# EAGLE design BusBlaster-v2.1a (EAGLE 5.10)
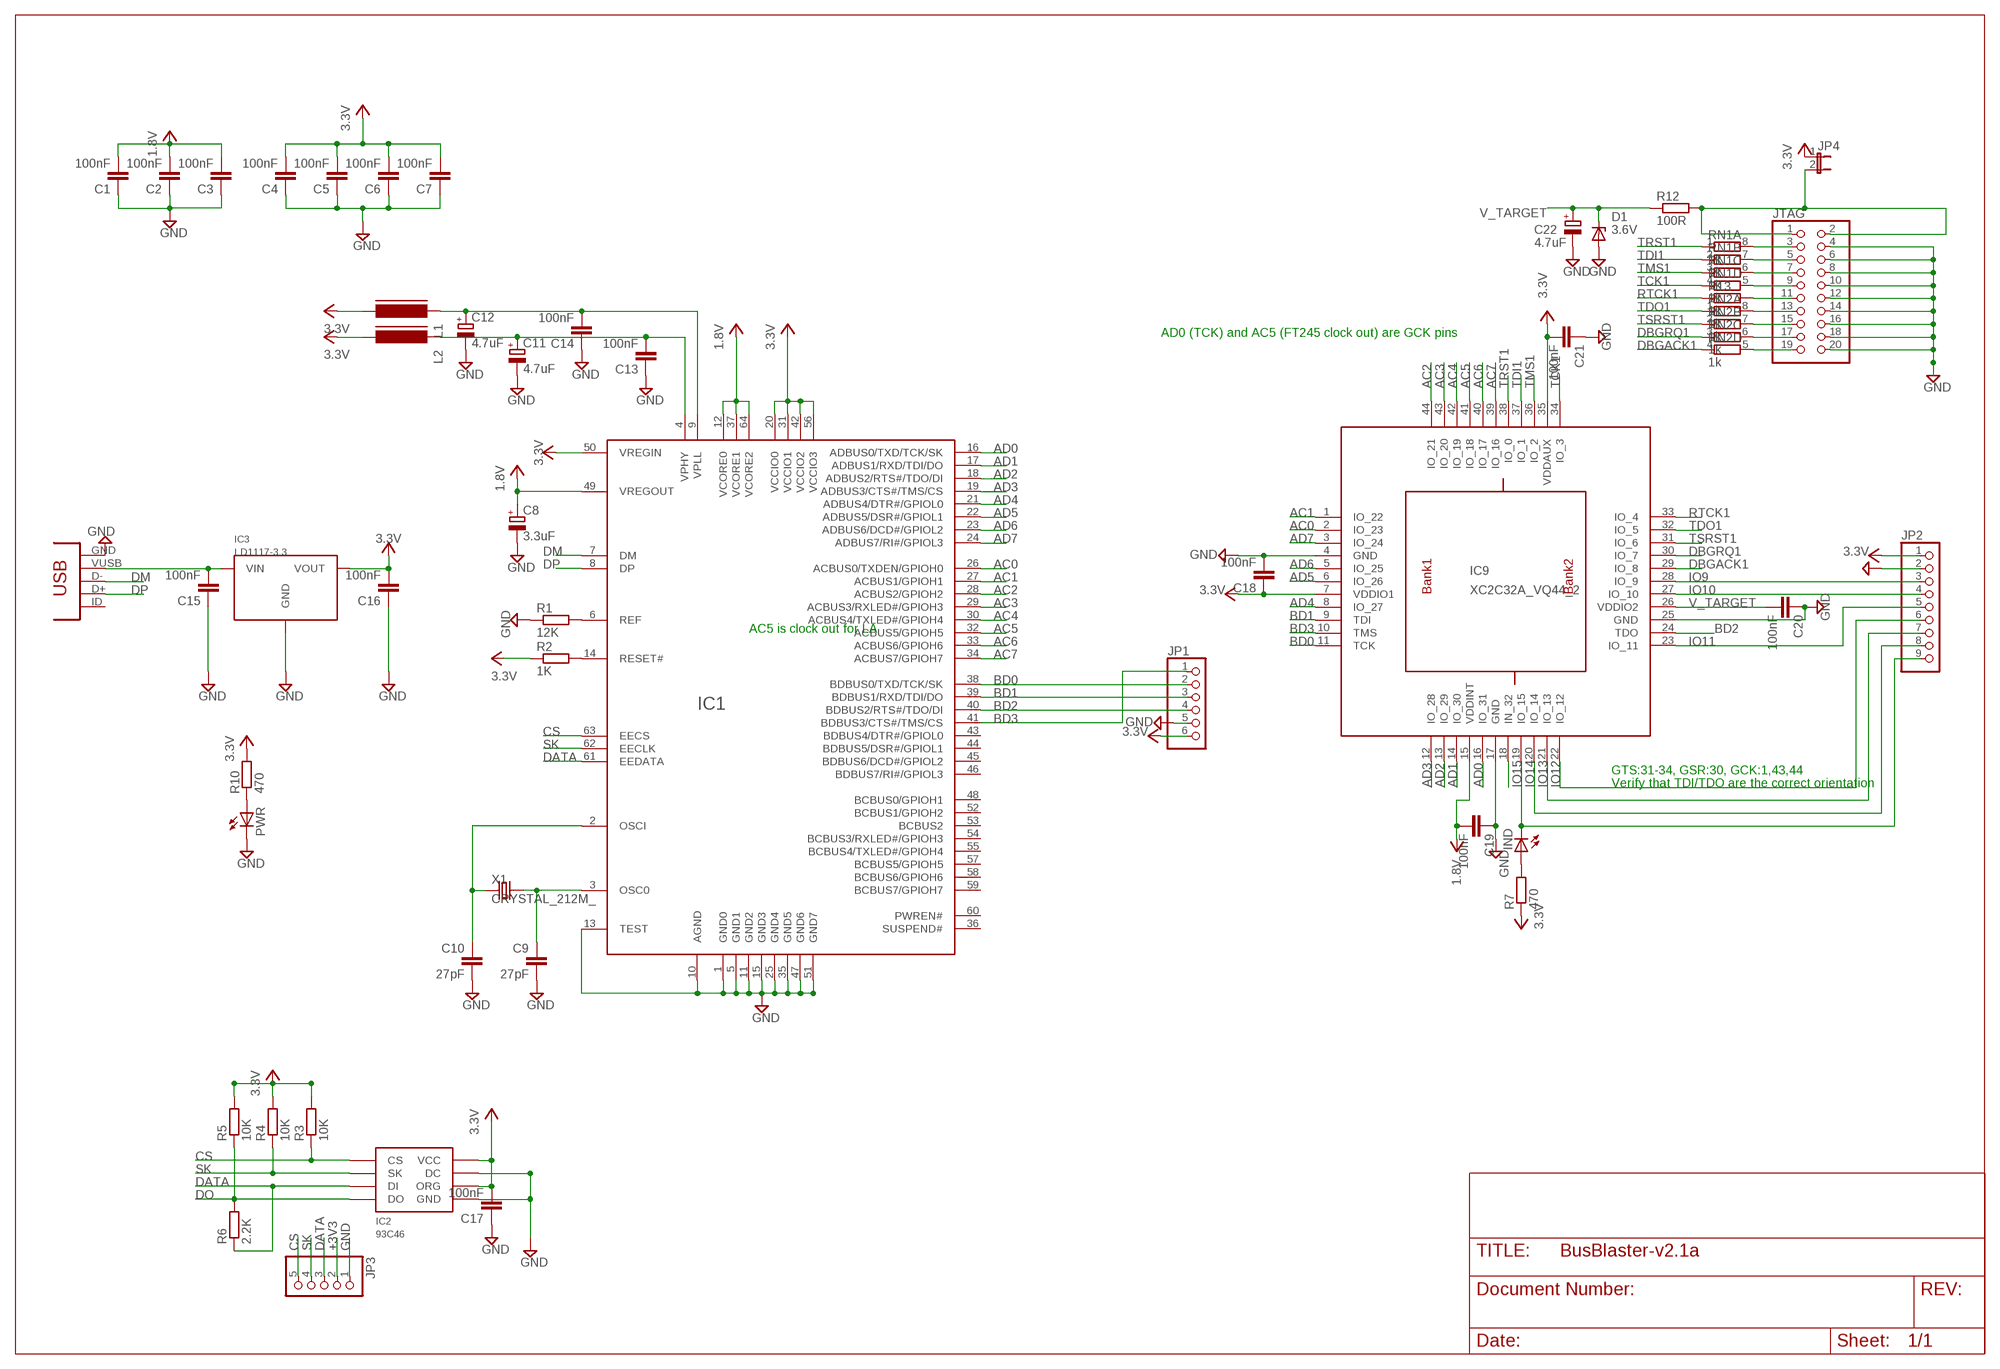
[diagram p0: schematic, sheet 1]

## Parts
C1  100nF  CAPC805  [C805]
C2  100nF  CAPC805  [C805]
C3  100nF  CAPC805  [C805]
C4  100nF  CAPC805  [C805]
C5  100nF  CAPC805  [C805]
C6  100nF  CAPC805  [C805]
C7  100nF  CAPC805  [C805]
C8  3.3uF  CAP_POLSMC_A  [SMC_A]
C9  27pF  CAPC805  [C805]
C10  27pF  CAPC805  [C805]
C11  4.7uF  CAP_POLSMC_A  [SMC_A]
C12  4.7uF  CAP_POLSMC_A  [SMC_A]
C13  100nF  CAPC805  [C805]
C14  100nF  CAPC805  [C805]
C15  100nF  CAPC805  [C805]
C16  100nF  CAPC805  [C805]
C17  100nF  CAPC805  [C805]
C18  100nF  CAPC805  [C805]
C19  100nF  CAPC805  [C805]
C20  100nF  CAPC805  [C805]
C21  100nF  CAPC805  [C805]
C22  4.7uF  CAP_POLSMC_A  [SMC_A]
D1  3.6V  ZENERSOD-123  [SOD-123]
IC1  FT2232H  [LQFP64]
IC2  93C46  [SOIC8]
IC3  LD1117-3.3  [SOT223]
IC9  XC2C32A_VQ44_2  [VQ44]
IND  LEDCHIPLED_0805  [CHIPLED_0805]
JP1  PINHD-1X6  [1X06]
JP2  PINHD-1X9  [1X09]
JP3  PINHD-1X5  [1X05]
JP4  JP1EJP  [1X02]
JTAG  PINHEAD_-_COPY_PINHD-2X10SHROUDED  [PINHEAD_-_COPY_PINSHRD_PTH_2X10]
L1  FERRITE_BEAD805  [FB805]
L2  FERRITE_BEAD805  [FB805]
PWR  LEDCHIPLED_0805  [CHIPLED_0805]
R1  12K  RESISTORR805R805  [R805]
R2  1K  RESISTORR805R805  [R805]
R3  10K  RESISTORR805R805  [R805]
R4  10K  RESISTORR805R805  [R805]
R5  10K  RESISTORR805R805  [R805]
R6  2.2K  RESISTORR805R805  [R805]
R7  470  RESISTORR805R805  [R805]
R10  470  RESISTORR805R805  [R805]
R12  100R  RESISTORR805R805  [R805]
R13  1k  RESISTORR805R805  [R805]
RN1  1k  RNETWORK  [RN8P-4R-CRA06S]
RN2  1k  RNETWORK  [RN8P-4R-CRA06S]
USB  CON-USB-MINI-BUSB1  [CONN_USB_MINI-B]
X1  CRYSTAL_212M_  [4X6]

## Nets
1.8V: C1.2 C2.2 C3.2 C8.+ C19.2 IC1.12(VCORE0) IC1.37(VCORE1) IC1.49(VREGOUT) IC1.64(VCORE2) IC9.15(VDDINT)
+3V3: C4.2 C5.2 C6.2 C7.2 C16.2 C17.2 C18.1 C21.2 IC1.20(VCCIO0) IC1.31(VCCIO1) IC1.42(VCCIO2) IC1.50(VREGIN) IC1.56(VCCIO3) IC2.6(ORG) IC2.8(VCC) IC3.2(VOUT) IC9.7(VDDIO1) IC9.35(VDDAUX) JP1.6 JP2.1 JP3.2 JP4.1 L1.2 L2.2 R2.1 R3.2 R4.2 R5.2 R7.1 R10.2 ; supply symbol labelled 3.3V
AC0: IC1.26(ACBUS0/TXDEN/GPIOH0) IC9.2(IO_23)
AC1: IC1.27(ACBUS1/GPIOH1) IC9.1(IO_22)
AC2: IC1.28(ACBUS2/GPIOH2) IC9.44(IO_21)
AC3: IC1.29(ACBUS3/RXLED#/GPIOH3) IC9.43(IO_20)
AC4: IC1.30(ACBUS4/TXLED#/GPIOH4) IC9.42(IO_19)
AC5: IC1.32(ACBUS5/GPIOH5) IC9.41(IO_18)
AC6: IC1.33(ACBUS6/GPIOH6) IC9.40(IO_17)
AC7: IC1.34(ACBUS7/GPIOH7) IC9.39(IO_16)
AD0: IC1.16(ADBUS0/TXD/TCK/SK) IC9.16(IO_31)
AD1: IC1.17(ADBUS1/RXD/TDI/DO) IC9.14(IO_30)
AD2: IC1.18(ADBUS2/RTS#/TDO/DI) IC9.13(IO_29)
AD3: IC1.19(ADBUS3/CTS#/TMS/CS) IC9.12(IO_28)
AD4: IC1.21(ADBUS4/DTR#/GPIOL0) IC9.8(IO_27)
AD5: IC1.22(ADBUS5/DSR#/GPIOL1) IC9.6(IO_26)
AD6: IC1.23(ADBUS6/DCD#/GPIOL2) IC9.5(IO_25)
AD7: IC1.24(ADBUS7/RI#/GPIOL3) IC9.3(IO_24)
BD0: IC1.38(BDBUS0/TXD/TCK/SK) IC9.11(TCK) JP1.2
BD1: IC1.39(BDBUS1/RXD/TDI/DO) IC9.9(TDI) JP1.3
BD2: IC1.40(BDBUS2/RTS#/TDO/DI) IC9.24(TDO) JP1.4
BD3: IC1.41(BDBUS3/CTS#/TMS/CS) IC9.10(TMS) JP1.1
CS: IC1.63(EECS) IC2.1(CS) JP3.5 R3.1
DATA: IC1.61(EEDATA) IC2.3(DI) JP3.3 R6.1
DBGACK1: IC9.29(IO_8) RN2.4
DBGRQ1: IC9.30(IO_7) RN2.3
DM: IC1.7(DM) USB.D-
DO: IC2.4(DO) R5.1 R6.2
DP: IC1.8(DP) USB.D+
GND: C1.1 C2.1 C3.1 C4.1 C5.1 C6.1 C7.1 C8.- C9.2 C10.2 C11.- C12.- C13.1 C14.1 C15.1 C16.1 C17.1 C18.2 C19.1 C20.1 C21.1 C22.- D1.A IC1.1(GND0) IC1.5(GND1) IC1.10(AGND) IC1.11(GND2) IC1.13(TEST) IC1.15(GND3) IC1.25(GND4) IC1.35(GND5) IC1.47(GND6) IC1.51(GND7) IC2.5(GND) IC2.7(DC) IC3.1(GND) IC9.4(GND) IC9.17(GND) IC9.18(IN_32) IC9.25(GND) JP1.5 JP2.2 JP3.1 JTAG.4 JTAG.6 JTAG.8 JTAG.10 JTAG.12 JTAG.14 JTAG.16 JTAG.18 JTAG.20 PWR.C R1.1 USB.GND
IO9: IC9.28(IO_9) JP2.3
IO10: IC9.27(IO_10) JP2.4
IO11: IC9.23(IO_11) JP2.5
IO12: IC9.22(IO_12) JP2.6
IO13: IC9.21(IO_13) JP2.7
IO14: IC9.20(IO_14) JP2.8
IO15: IC9.19(IO_15) IND.C JP2.9
N$1: C9.1 IC1.3(OSC0) X1.2(X2)
N$2: C10.1 IC1.2(OSCI) X1.1(X1)
N$3: IC1.14(RESET#) R2.2
N$4: IC1.6(REF) R1.2
N$5: C15.2 IC3.3(VIN) USB.VUSB
N$6: PWR.A R10.1
N$7: IND.A R7.2
N$9: JTAG.13 RN2.8
N$10: JTAG.15 RN2.7
N$11: JTAG.17 RN2.6
N$12: JTAG.19 RN2.5
N$13: JTAG.3 RN1.8
N$14: JTAG.5 RN1.7
N$15: JTAG.7 RN1.6
N$16: JTAG.9 RN1.5
N$17: JTAG.11 R13.2
RTCK1: IC9.33(IO_4) R13.1
SK: IC1.62(EECLK) IC2.2(SK) JP3.4 R4.1
TCK1: IC9.34(IO_3) RN1.4
TDI1: IC9.37(IO_1) RN1.2
TDO1: IC9.32(IO_5) RN2.1
TMS1: IC9.36(IO_2) RN1.3
TRST1: IC9.38(IO_0) RN1.1
TSRST1: IC9.31(IO_6) RN2.2
V_TARGET: C20.2 C22.+ D1.C IC9.26(VDDIO2) R12.1
V_TARGET_UNREG: JP4.2 JTAG.1 JTAG.2 R12.2
VPHY: C11.+ C13.2 IC1.4(VPHY) L2.1
VPLL: C12.+ C14.2 IC1.9(VPLL) L1.1
Unconnected: IC1.36(SUSPEND#) IC1.43(BDBUS4/DTR#/GPIOL0) IC1.44(BDBUS5/DSR#/GPIOL1) IC1.45(BDBUS6/DCD#/GPIOL2) IC1.46(BDBUS7/RI#/GPIOL3) IC1.48(BCBUS0/GPIOH1) IC1.52(BCBUS1/GPIOH2) IC1.53(BCBUS2) IC1.54(BCBUS3/RXLED#/GPIOH3) IC1.55(BCBUS4/TXLED#/GPIOH4) IC1.57(BCBUS5/GPIOH5) IC1.58(BCBUS6/GPIOH6) IC1.59(BCBUS7/GPIOH7) IC1.60(PWREN#) USB.BODY@1(BODY) USB.BODY@2(BODY) USB.BODY@3(BODY) USB.BODY@4(BODY) USB.ID(USBID)

## Notes on the sheet
- AD0 (TCK) and AC5 (FT245 clock out) are GCK pins
- AC5 is clock out for LA
- GTS:31-34, GSR:30, GCK:1,43,44
- Verify that TDI/TDO are the correct orientation

## Library data of the parts
C1-C7 C9 C10 C13-C21 = DP-EagleLibrary:CAP
C8 C11 C12 C22 = DP-EagleLibrary:CAP_POL
D1 = dp_devices:ZENER: Zener Diode SOD-323
IC1 = dp_devices:FT2232H: DUAL HIGH SPEED USB TO MULTIPURPOSE UART/FIFO IC
IC2 = DP-EagleLibrary:93C46
IC3 = DP-EagleLibrary:LD1117-3.3
IC9 = dp_devices:XC2C32A_VQ44_2: xc2c32a_vq44-ian edit this description Auto generated by make-symbol-device-package-bsdl.ulp Rev. 29 Source: xc2c32a_vq44-ian.bsd
IND PWR = led:LED: LED OSRAM: - CHIPLED LG R971, LG N971, LY N971, LG Q971, LY Q971, LO R971, LY R971 LH N974, LH R974 LS Q976, LO Q976, LY Q976 LO Q996 - Hyper CHIPLED LW Q18S LB Q993, LB Q99A, LB R99A - SideLED LS A670, LO A670, LY A670, LG A670, LP A670 LB A673, LV A673, LT A673, LW A673 LH A674 LY A675 LS A676, LA A676, LO A676, LY A676, LW A676 LS A679, LY A679, LG A679 - Hyper Micro SIDELED® LS Y876, LA Y876, LO Y876, LY Y876 LT Y87S - SmartLED LW L88C, LW L88S LB L89C, LB L89S, LG L890 LS L89K, LO L89K, LY L89K LS L896, LA L896, LO L896, LY L896 - TOPLED LS T670, LO T670, LY T670, LG T670, LP T670 LSG T670, LSP T670, LSY T670, LOP T670, LYG T670 LG T671, LOG T671, LSG T671 LB T673, LV T673, LT T673, LW T673 LH T674 LS T676, LA T676, LO T676, LY T676, LB T676, LH T676, LSB T676, LW T676 LB T67C, LV T67C, LT T67C, LS T67K, LO T67K, LY T67K, LW E67C LS E67B, LA E67B, LO E67B, LY E67B, LB E67C, LV E67C, LT E67C LW T67C LS T679, LY T679, LG T679 LS T770, LO T770, LY T770, LG T770, LP T770 LB T773, LV T773, LT T773, LW T773 LH T774 LS E675, LA E675, LY E675, LS T675 LS T776, LA T776, LO T776, LY T776, LB T776 LHGB T686 LT T68C, LB T68C - Hyper Mini TOPLED® LB M676 - Mini TOPLED Santana® LG M470 LS M47K, LO M47K, LY M47K Source: http://www.osram.convergy.de LUXEON: - LUMILED® LXK2-PW12-R00, LXK2-PW12-S00, LXK2-PW14-U00, LXK2-PW14-V00 LXK2-PM12-R00, LXK2-PM12-S00, LXK2-PM14-U00 LXK2-PE12-Q00, LXK2-PE12-R00, LXK2-PE12-S00, LXK2-PE14-T00, LXK2-PE14-U00 LXK2-PB12-K00, LXK2-PB12-L00, LXK2-PB12-M00, LXK2-PB14-N00, LXK2-PB14-P00, LXK2-PB14-Q00 LXK2-PR12-L00, LXK2-PR12-M00, LXK2-PR14-Q00, LXK2-PR14-R00 LXK2-PD12-Q00, LXK2-PD12-R00, LXK2-PD12-S00 LXK2-PH12-R00, LXK2-PH12-S00 LXK2-PL12-P00, LXK2-PL12-Q00, LXK2-PL12-R00 Source: www.luxeon.com KINGBRIGHT: KA-3528ASYC Source: www.kingbright.com
JP1 = pinhead:PINHD-1X6: PIN HEADER
JP2 = pinhead - Copy:PINHD-1X9: PIN HEADER
JP3 = pinhead:PINHD-1X5: PIN HEADER
JP4 = jumper:JP1E: JUMPER
JTAG = LPC1768board:PINHEAD_-_COPY_PINHD-2X10: PIN HEADER
L1 L2 = DP-EagleLibrary:FERRITE_BEAD
R1-R7 R10 R12 R13 = DP-EagleLibrary:RESISTOR
RN1 RN2 = dp_devices:RNETWORK: 4 Resistor Array 0603
USB = dp_devices:CON-USB-MINI-B: USB connector
X1 = dp_devices:CRYSTAL_2

## Board
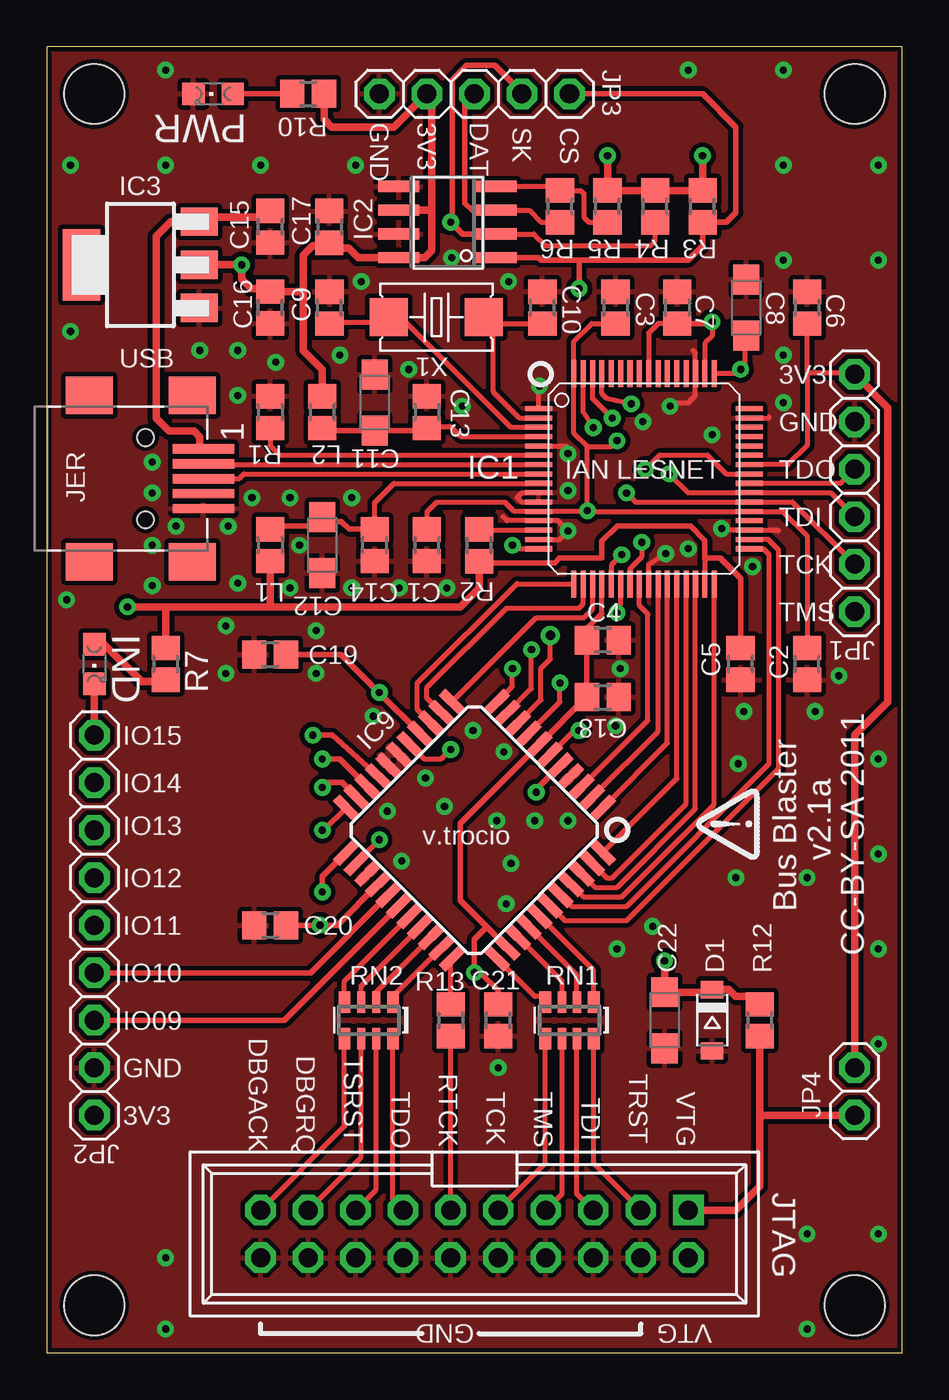
[diagram p1: board, top side]
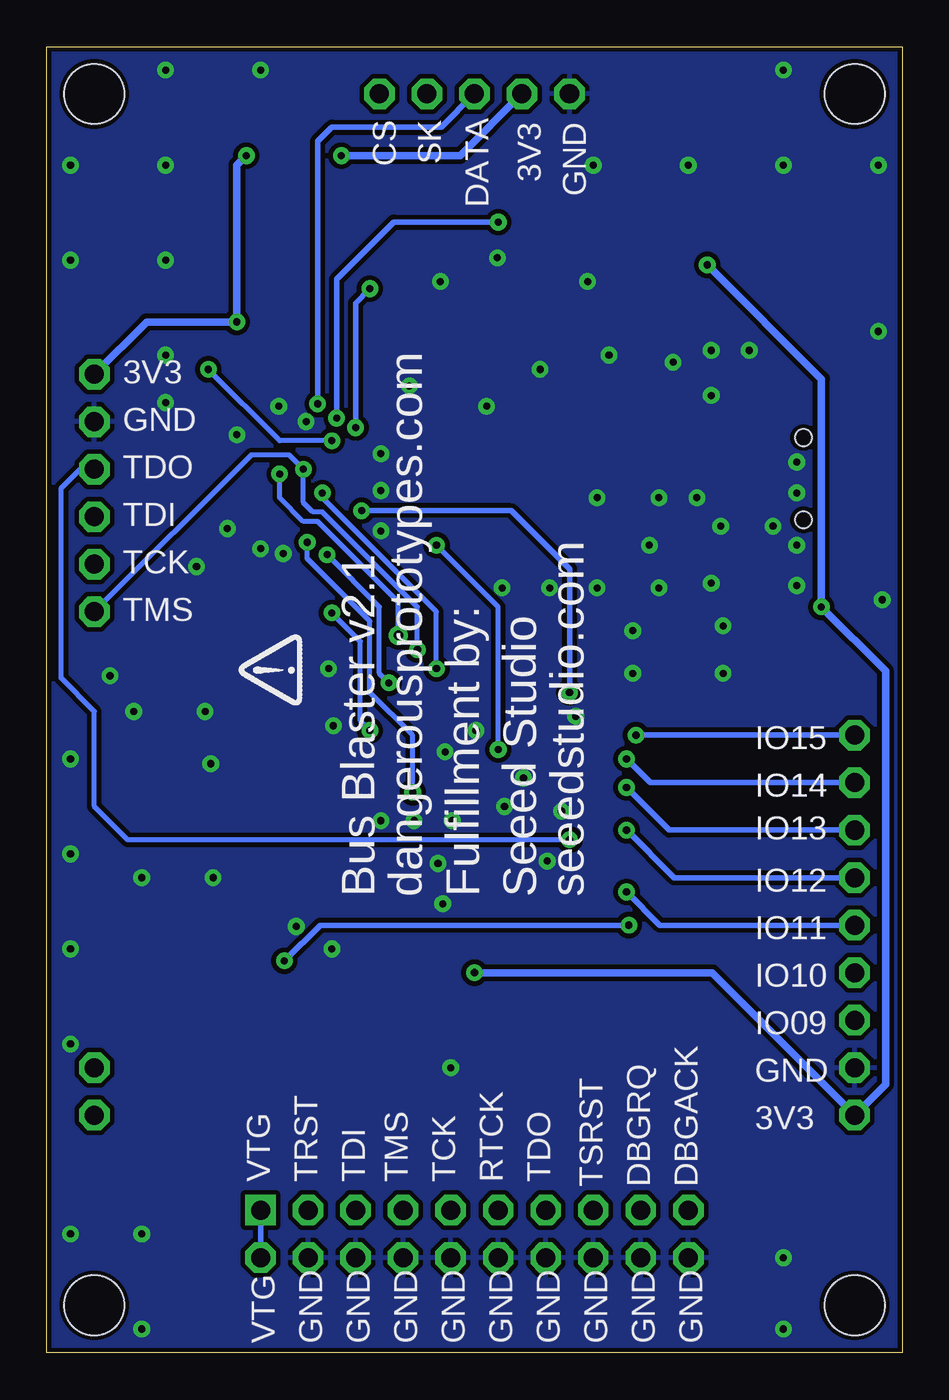
[diagram p2: board, bottom side, seen from below]

Size 45.72 x 69.83 mm. Coordinates in mm from the lower left corner, seen from the top.
Outline: 0,0 45.72,0 45.72,69.83 0,69.83 0,0
Copper layers (1*16): Top 0.035mm / dielectric 1.5mm / Bottom 0.035mm
Design rules "SparkFun": minimum track width 8mil, minimum drill 20mil, track to track 8mil, track to pad 8mil, pad to pad 8mil, via to via 8mil, smd to smd 8mil, copper to edge 10mil, drill to drill 8mil, minimum pad ring 12mil, minimum via ring 10mil, stop-mask expansion 4mil, vias tented up to drill 25mil, thermal gap 10mil
Holes 3.2 mm at 2.54,2.54 2.54,67.31 43.18,67.31 43.18,2.54

### Footprints (pad centres in the part's own frame; a part is rotated, then mirrored left to right if it is on the bottom)
C805 = smd 1.3 x 1.5: 1 -0.85,0; 2 0.85,0
SMC_A = smd 1.6 x 1.4: + -1.5,0; - 1.5,0
SOD-123 = smd 0.91 x 1.22: A 1.635,0; C -1.635,0
LQFP64 = smd 1.45 x 0.27: 1 -5.625,3.75; 2 -5.625,3.25; 3 -5.625,2.75; 4 -5.625,2.25; 5 -5.625,1.75; 6 -5.625,1.25; 7 -5.625,0.75; 8 -5.625,0.25; 9 -5.625,-0.25; 10 -5.625,-0.75; 11 -5.625,-1.25; 12 -5.625,-1.75; 13 -5.625,-2.25; 14 -5.625,-2.75; 15 -5.625,-3.25; 16 -5.625,-3.75; 33 5.625,-3.75; 34 5.625,-3.25; 35 5.625,-2.75; 36 5.625,-2.25; 37 5.625,-1.75; 38 5.625,-1.25; 39 5.625,-0.75; 40 5.625,-0.25; 41 5.625,0.25; 42 5.625,0.75; 43 5.625,1.25; 44 5.625,1.75; 45 5.625,2.25; 46 5.625,2.75; 47 5.625,3.25; 48 5.625,3.75 | smd 0.27 x 1.45: 17 -3.75,-5.625; 18 -3.25,-5.625; 19 -2.75,-5.625; 20 -2.25,-5.625; 21 -1.75,-5.625; 22 -1.25,-5.625; 23 -0.75,-5.625; 24 -0.25,-5.625; 25 0.25,-5.625; 26 0.75,-5.625; 27 1.25,-5.625; 28 1.75,-5.625; 29 2.25,-5.625; 30 2.75,-5.625; 31 3.25,-5.625; 32 3.75,-5.625; 49 3.75,5.625; 50 3.25,5.625; 51 2.75,5.625; 52 2.25,5.625; 53 1.75,5.625; 54 1.25,5.625; 55 0.75,5.625; 56 0.25,5.625; 57 -0.25,5.625; 58 -0.75,5.625; 59 -1.25,5.625; 60 -1.75,5.625; 61 -2.25,5.625; 62 -2.75,5.625; 63 -3.25,5.625; 64 -3.75,5.625
SOIC8 = smd 0.6 x 2.2: 1 -1.905,-2.6; 2 -0.635,-2.6; 3 0.635,-2.6; 4 1.905,-2.6; 5 1.905,2.6; 6 0.635,2.6; 7 -0.635,2.6; 8 -1.905,2.6
SOT223 = smd 1.5 x 2: 1 -2.3,-3.15; 2 0,-3.15; 3 2.3,-3.15 | smd 3.8 x 2: 4 0,3.15
VQ44 = smd 1.5 x 0.5: 1 -5.7,4; 2 -5.7,3.2; 3 -5.7,2.4; 4 -5.7,1.6; 5 -5.7,0.8; 6 -5.7,0; 7 -5.7,-0.8; 8 -5.7,-1.6; 9 -5.7,-2.4; 10 -5.7,-3.2; 11 -5.7,-4; 23 5.7,-4; 24 5.7,-3.2; 25 5.7,-2.4; 26 5.7,-1.6; 27 5.7,-0.8; 28 5.7,0; 29 5.7,0.8; 30 5.7,1.6; 31 5.7,2.4; 32 5.7,3.2; 33 5.7,4 | smd 0.5 x 1.5: 12 -4,-5.7; 13 -3.2,-5.7; 14 -2.4,-5.7; 15 -1.6,-5.7; 16 -0.8,-5.7; 17 0,-5.7; 18 0.8,-5.7; 19 1.6,-5.7; 20 2.4,-5.7; 21 3.2,-5.7; 22 4,-5.7; 34 4,5.7; 35 3.2,5.7; 36 2.4,5.7; 37 1.6,5.7; 38 0.8,5.7; 39 0,5.7; 40 -0.8,5.7; 41 -1.6,5.7; 42 -2.4,5.7; 43 -3.2,5.7; 44 -4,5.7
CHIPLED_0805 = smd 1.2 x 1.2: A 0,-1.05; C 0,1.05
1X06 = drill 1.016 octagon: 1 -6.35,0; 2 -3.81,0; 3 -1.27,0; 4 1.27,0; 5 3.81,0; 6 6.35,0
1X09 = drill 1.016 octagon: 1 -10.16,0; 2 -7.62,0; 3 -5.08,0; 4 -2.54,0; 5 0,0; 6 2.54,0; 7 5.08,0; 8 7.62,0; 9 10.16,0
1X05 = drill 1.016 octagon: 1 -5.08,0; 2 -2.54,0; 3 0,0; 4 2.54,0; 5 5.08,0
1X02 = drill 1.016 octagon: 1 -1.27,0; 2 1.27,0
PINHEAD_-_COPY_PINSHRD_PTH_2X10 = drill 1.016 square: 1 -11.43,-1.27 | drill 1.016 octagon: 2 -11.43,1.27; 3 -8.89,-1.27; 4 -8.89,1.27; 5 -6.35,-1.27; 6 -6.35,1.27; 7 -3.81,-1.27; 8 -3.81,1.27; 9 -1.27,-1.27; 10 -1.27,1.27; 11 1.27,-1.27; 12 1.27,1.27; 13 3.81,-1.27; 14 3.81,1.27; 15 6.35,-1.27; 16 6.35,1.27; 17 8.89,-1.27; 18 8.89,1.27; 19 11.43,-1.27; 20 11.43,1.27
FB805 = smd 1.3 x 1.5: 1 -0.85,0; 2 0.85,0
R805 = smd 1.3 x 1.5: 1 -0.85,0; 2 0.85,0
RN8P-4R-CRA06S = smd 0.63 x 1.15: 1 -1.295,-0.975; 4 1.295,-0.975; 5 1.295,0.975; 8 -1.295,0.975 | smd 0.44 x 1.15: 2 -0.4,-0.975; 3 0.4,-0.975; 6 0.4,0.975; 7 -0.4,0.975
CONN_USB_MINI-B = smd 2 x 2.5: BODY@1 -4.45,2.5; BODY@2 4.45,2.5; BODY@3 4.45,-3; BODY@4 -4.45,-3 | smd 0.5 x 3.3: D+ 0,3.1; D- -0.8,3.1; GND 1.6,3.1; ID 0.8,3.1; VUSB -1.6,3.1 | hole 0.9: -2.2,0; 2.2,0
4X6@1 = smd 2.032 x 2.032: 1 -2.54,0; 2 2.54,0

### Placement (x,y rotation side)
C1  20.32,43.18 90 top
C2  40.64,36.83 90 top
C3  30.4,55.88 270 top
C4  29.72,38.1 180 top
C5  37.08,36.83 90 top
C6  40.64,55.88 270 top
C7  33.7,55.88 270 top
C8  37.38,55.88 90 top
C9  15.11,55.88 90 top
C10  26.5,55.88 90 top
C11  17.53,50.8 90 top
C12  14.73,43.18 270 top
C13  20.32,50.29 270 top
C14  17.53,43.18 90 top
C15  11.94,60.2 90 top
C16  11.94,55.88 90 top
C17  15.11,60.2 270 top
C18  29.72,35.05 0 top
C19  11.94,37.34 0 top
C20  11.94,22.86 0 top
C21  24.13,17.78 90 top
C22  33.02,17.78 270 top
D1  35.56,17.78 270 top
IC1  31.92,46.74 0 top
IC2  21.42,60.45 90 top
IC3  5,58.17 90 top
IC9  22.86,27.94 225 top
IND  2.54,36.83 180 top
JP1  43.18,45.97 90 top
JP2  2.54,22.86 90 top
JP3  22.86,67.31 0 top
JP4  43.18,13.97 270 top
JTAG  22.86,6.35 180 top
L1  11.94,43.18 270 top
L2  14.73,50.29 90 top
PWR  8.89,67.31 90 top
R1  11.94,50.29 270 top
R2  23.11,43.18 90 top
R3  35.05,61.29 90 top
R4  32.51,61.29 90 top
R5  29.97,61.29 90 top
R6  27.43,61.29 90 top
R7  6.35,36.83 270 top
R10  13.97,67.31 0 top
R12  38.1,17.78 270 top
R13  21.59,17.78 270 top
RN1  27.94,17.78 180 top
RN2  17.21,17.78 180 top
U$1  [DP-LOGO-BOTTOM]  32.07,38.42 270 top
U$2  [DP-LOGO_TOP]  38.1,26.35 90 top
USB  5.27,46.74 270 top
X1  CRYSTAL_212M_  [4X6@1]  20.83,55.37 180 top

### Tracks (layer width: path | path; a pad name or v marks a point on that pad's centre or on a via)
1.8V  (via drill 0.38)
  Top 0.254: 28.88,48.45 28.17,49.15 IC1.64 28.17,54.08 29.12,55.03 C3.2 | 28.88,44.99 28.88,48.45 | C8.+ 37.34,54.33 37.34,52.83 v37.08,52.58 36.87,52.36 IC1.49 | C1.2 20.32,44.96 20.83,45.47 24.51,45.47 24.99,44.99 IC1.12 28.86,44.99 v28.89,45.02 28.89,44.99 IC1.37 39.34,44.99 40.64,43.69 C2.2 | 28.88,48.45 30.16,48.45 v30.48,48.77
  Top 0.305: C19.2 15.72,37.34 17.76,35.31 | 17.76,35.31 IC9.15 | 17.76,35.31 v17.78,35.31 | 28.88,44.99 28.88,45 v28.89,45.02
  Bottom 0.254: v37.08,52.58 33.27,48.77 v30.48,48.77
  Bottom 0.305: v17.78,35.31 17.78,41.91 20.89,45.02 v28.89,45.02
+3V3  (via drill 0.38)
  Top 0.254: IC1.56 32.17,54.53 32.68,55.03 C7.2 | C4.2 28.87,38.71 29.67,39.52 IC1.20 | IC1.50 35.17,53.97 35.56,54.36 v35.56,55.12 | 40.64,52.39 40.64,48.51 39.61,47.49 IC1.42 | 35.17,42.48 IC1.31 | 40.64,52.39 C6.2 | 40.64,52.39 43.12,52.39 JP1.6
  Top 0.305: C4.2 C18.1 28.84,35.05 IC9.7 22.1,28.31 22.1,24.18 23.52,22.76 | C5.2 37.08,41.41 36.01,42.48 35.17,42.48 35.17,43.44 34.42,44.2 30.48,44.2 29.67,43.39 29.67,42.48 27.4,42.48 27.15,42.23 23.5,42.23 23.4,42.33 R2.1 | 23.52,22.76 IC9.35 | C7.2 35.47,55.03 v35.56,55.12 | C21.2 24.13,19.37 23.18,20.32 v22.86,20.32 22.86,22.1 23.52,22.76
  Top 0.406: C17.2 15.58,59.69 | C17.2 14.95,59.05 16.13,59.05 16.64,58.55 IC2.8 20.19,58.55 20.57,58.93 20.57,61.09 | 8.66,58.14 IC3.2 v10.41,58.17 10.41,57.4 10.92,56.9 12.03,56.9 | 12.03,56.9 11.78,57.15 | L2.2 14.73,52.58 13.72,53.59 13.72,56.9 | 13.72,56.9 13.72,58.67 14.22,59.18 15.2,59.18 C17.2 | 13.72,56.9 13.71,56.73 C16.2 12.03,56.9 | 20.57,61.09 IC2.6 | v29.97,64.01 R5.2 R4.2 R3.2 v35.05,64.01 | 11.94,39.88 22.1,39.88 23.11,40.89 R2.1 | 11.94,39.88 L1.2 | 20.57,61.09 20.57,67.06 JP3.2 18.54,65.53 15.24,65.53 14.82,65.95 R10.2 | v4.32,39.88 6.35,39.88 | 6.35,39.88 11.94,39.88 | JP1.6 44.96,50.55 44.96,34.8 43.18,33.02 JP4.1 | 6.35,39.88 R7.1
  Bottom 0.406: v35.05,64.01 35.56,63.5 v35.56,55.12 40.39,55.12 JP1.6 | v29.97,64.01 23.62,64.01 JP3.2 | v22.86,20.32 10.16,20.32 JP2.1 0.89,14.35 0.89,36.45 v4.32,39.88 4.32,52.07 v10.41,58.17
AC0
  Top 0.254: IC9.2 32.67,33.23 32.67,40.64 IC1.26
AC1
  Top 0.254: IC9.1 33.17,32.6 33.17,40.64 IC1.27
AC2
  Top 0.254: IC9.44 33.67,30.69 33.67,40.64 IC1.28
AC3
  Top 0.254: IC9.43 29.93,25.4 30.23,25.4 34.17,29.35 34.17,40.64 IC1.29
AC4
  Top 0.254: IC9.42 29.3,24.89 30.48,24.89 34.67,29.09 34.67,40.64 IC1.30
AC5
  Top 0.254: IC1.32 35.67,29.32 30.73,24.38 28.68,24.38 IC9.41
AC6
  Top 0.254: IC9.40 28.05,23.88 30.99,23.88 38.61,31.5 38.61,42.67 38.29,42.99 IC1.33
AC7
  Top 0.254: IC9.39 27.69,23.11 30.99,23.11 39.12,31.24 39.12,42.93 38.56,43.49 IC1.34
AD0  (via drill 0.38)
  Top 0.254: IC1.16 25.09,42.99 v24.89,43.18 | v21.59,32.26 21.08,31.75 20.18,31.75 IC9.16
  Bottom 0.254: v24.89,43.18 21.59,39.88 v21.59,32.26
AD1
  Top 0.254: IC9.14 19.81,34.38 19.81,35.81 25.13,41.14 25.16,41.11 IC1.17
AD2
  Top 0.254: IC9.13 20.32,35 20.32,35.56 24.57,39.81 28.45,39.81 28.67,40.04 IC1.18
AD3
  Top 0.254: IC9.12 26.17,39.31 28.7,39.31 29.17,39.78 IC1.19
AD4  (via drill 0.38)
  Top 0.254: IC9.8 25.76,33.12 27.43,34.8 v27.43,35.81 | v30.73,42.67 30.23,42.16 30.17,42.11 IC1.21
  Bottom 0.254: v30.73,42.67 27.94,39.88 27.94,36.32 v27.43,35.81
AD5  (via drill 0.38)
  Top 0.254: v30.48,39.56 30.67,40.07 IC1.22 | v28.45,33.27 28.19,33.27 IC9.6
  Bottom 0.254: v28.45,33.27 28.96,33.78 28.96,38.04 v30.48,39.56
AD6  (via drill 0.38)
  Top 0.254: IC1.23 31.17,41.92 31.8,42.55 v31.8,43.33
  Top 0.305: IC9.5 26.16,30.11 v26.16,29.97
  Bottom 0.254: v31.8,43.33 31.8,42.47 28.45,39.12 28.45,35.31 26.16,33.02 v26.16,29.97
AD7
  Top 0.254: IC9.3 32.13,33.82 32.13,39.5 31.67,39.95 31.67,40.64 IC1.24
BD0  (via drill 0.38)
  Top 0.254: IC9.11 24.89,35.63 v24.89,36.58 | v30.99,45.97 31.48,45.49 IC1.38 39.86,45.49 JP1.2
  Bottom 0.254: v24.89,36.58 24.89,39.62 30.99,45.72 v30.99,45.97
BD1  (via drill 0.38, 0.51)
  Top 0.254: JP1.3 41.9,45.99 IC1.39 34.28,45.99 v33.27,46.99 | v26.92,38.35 26.92,37.08 26.42,36.58 26.42,34.89 IC9.9
  Bottom 0.254: v33.27,46.99 33.27,45.72 32,44.45 31.24,44.45 26.92,40.13 v26.92,38.35
BD2  (via drill 0.38 pad 0.38)
  Top 0.254: IC1.40 42.42,46.49 JP1.4 | IC9.24 16.57,26.22 v17.78,27.43
  Bottom 0.254: v17.78,27.43 41.4,27.43 43.18,29.21 43.18,34.29 44.96,36.07 44.96,46.23 43.94,47.24 JP1.4
BD3  (via drill 0.38)
  Top 0.254: IC9.10 25.91,35.51 v25.91,37.59 | v32,47.24 32.77,48.01 35.31,48.01 36.33,46.99 IC1.41
  Bottom 0.254: v25.91,37.59 25.91,39.88 30.99,44.96 31.5,44.96 32,45.47 v32,47.24 32.77,48.01 34.8,48.01 JP1.1
CS  (via drill 0.38)
  Top 0.254: v29.21,49.47 28.67,50.32 IC1.63
  Top 0.305: IC2.1 26.29,58.55 26.42,58.42 28.45,58.42 | 28.45,58.42 34.29,58.42 35.05,59.18 R3.1 35.06,60.45 36.32,60.45 36.83,60.96 36.83,65.53 35.05,67.31 JP3.5 | v28.45,56.9 28.45,58.42
  Bottom 0.305: v29.21,49.47 29.21,56.13 v28.45,56.9
DATA  (via drill 0.38)
  Top 0.254: IC2.3 25.78,61.09 26.42,60.45 27.42,60.45 R6.1 | IC1.61 29.67,51.29 29.91,51.05 v31.24,50.74
  Top 0.305: JP3.3 22.35,66.8 22.35,61.47 22.73,61.09 IC2.3
  Bottom 0.305: v31.24,50.74 31.24,64.77 30.48,65.53 24.64,65.53 JP3.3
DBGACK1
  Top 0.254: IC9.29 15.91,19.86 RN2.4
DBGRQ1
  Top 0.254: IC9.30 16.81,19.63 RN2.3
DM
  Top 0.254: 8.89,47.49 8.24,47.49 | 8.89,47.49 IC1.7 | USB.D- 8.89,47.54 8.89,47.49
DO
  Top 0.254: IC2.4 27.05,62.36 27.18,62.48 27.09,62.48 R6.2 28.53,62.14 28.7,61.98 28.7,60.71 28.96,60.45 29.96,60.45 R5.1
DP
  Top 0.254: IC1.8 10.54,46.99 10.29,46.74 USB.D+
GND  (via drill 0.38)
  Top 0.254: 38.61,50.04 38.61,49.99 IC1.47 | 39.12,43.94 39.07,43.99 IC1.35 36.07,43.99 v36.07,44.07 | IC1.11 25.38,45.49 25.15,45.72 25.41,45.99 IC1.10 | 24.38,44.7 24.6,44.49 IC1.13 27.32,44.49 v27.86,43.94 27.4,43.49 IC1.15 | 34.54,53.59 34.67,53.46 IC1.51 34.67,51.18 34.29,50.8 33.51,50.8 v33.32,50.61 | IC1.25 32.17,42.14 v33.08,42.74 | IC1.5 27.76,48.49 v27.86,48.07 | IC1.1 26.3,51.65 v26.34,51.69
  other vias: 19.35,52.58 10.97,45.72 9.7,44.2 37.26,34.29 30.4,33.53 30.65,36.58 5.63,45.97 13.51,43.18 13,40.89 18.84,40.89 21.38,40.89 16.3,40.89 24.05,28.45 27.86,28.45 18.21,28.96 20.24,30.73 22.78,33.27 14.4,38.61 14.4,36.32 17.45,34.04 26.08,28.45 32.38,22.8 30.48,21.59 36.83,25.4 39.37,68.58 39.37,63.5 39.37,58.42 44.45,58.42 44.45,63.5 34.29,68.58 6.35,68.58 1.27,63.5 6.35,63.5 11.43,63.5 16.51,63.5 1.27,54.61 6.35,1.27 6.35,5.08 40.64,1.27 44.45,21.59 40.64,25.4 44.45,16.51 18.97,26.29 24.81,26.16 24.56,24 24.43,32.13 21.26,29.21 39.37,53.34 35.56,49.09 39.37,50.8 37.72,42.04 36.96,31.5 34.29,42.99 27.86,46.1 31.86,49.78 15.67,53.34 16.81,57.28 24.68,57.28 21.64,58.55 22.21,50.61 12.24,52.96 8.18,53.59 10.21,51.18 5.63,47.62 5.63,41.02 10.21,41.15 1.06,40.26 10.21,53.59 9.57,38.86 9.57,36.32 13,45.72 16.3,45.72 5.63,43.18 6.91,44.2 44.45,26.67 44.45,31.75 44.45,6.35 40.64,6.35 24.13,15.24 41.07,34.29 42.34,36.2
  pour Bottom (isolate 0.254): 0,69.83 0,0 45.72,0 45.72,69.83
  pour Top (isolate 0.254): 0,69.83 0,0 45.72,0 45.72,69.83
IO9
  Top 0.305: JP2.3 12.7,17.78 IC9.28
IO10
  Top 0.305: JP2.4 14.11,20.32 IC9.27
IO11  (via drill 0.38)
  Top 0.305: IC9.23 14.73,25.47 v14.73,24.64
  Bottom 0.305: v14.73,24.64 12.95,22.86 JP2.5
IO12  (via drill 0.38)
  Top 0.305: IC9.22 14.8,27.94 v14.73,27.94
  Bottom 0.305: v14.73,27.94 12.19,25.4 JP2.6
IO13  (via drill 0.38)
  Top 0.305: IC9.21 15.79,30.48 14.99,30.48 v14.73,30.23
  Bottom 0.305: v14.73,30.23 12.45,27.94 JP2.7
IO14  (via drill 0.38)
  Top 0.305: IC9.20 15.66,31.75 v14.73,31.75
  Bottom 0.305: v14.73,31.75 13.46,30.48 JP2.8
IO15  (via drill 0.38)
  Top 0.305: IC9.19 15.26,33.02 v14.22,33.02
  Top 0.406: JP2.9 IND.C
  Bottom 0.305: JP2.9 v14.22,33.02
N$1
  Top 0.254: C9.1 15.37,55.24 15.24,55.12 18.03,55.12 X1.2 | X1.2 18.29,55.63 18.54,55.37 | X1.2 18.54,55.12 19.18,55.12 24.81,49.49 IC1.3
N$2
  Top 0.254: 23.62,55.37 23.88,55.12 23.88,55.03 | 23.88,55.03 23.71,55.03 X1.1 | 23.88,55.03 C10.1 | IC1.2 25.26,49.99 23.88,51.37 23.88,55.03
N$3
  Top 0.254: IC1.14 23.15,43.99 R2.2
N$4
  Top 0.254: IC1.6 12.47,47.99 11.94,48.51 R1.2
N$5
  Top 0.406: C15.2 12.19,60.71 8.9,60.71 IC3.3 6.62,60.47 5.84,59.69 5.84,49.98 6.54,49.28 7.87,49.28 8.19,48.96 8.19,48.34 USB.VUSB
N$6
  Top 0.305: PWR.A R10.1
N$7
  Top 0.406: IND.A 3.08,37.88 5.08,35.88 6.25,35.88 R7.2
N$9
  Top 0.254: JTAG.13 18.5,8.17 RN2.8
N$10
  Top 0.254: JTAG.15 17.61,8.72 RN2.7
N$11
  Top 0.254: JTAG.17 16.81,10.46 RN2.6
N$12
  Top 0.254: JTAG.19 15.91,12.1 RN2.5
N$13
  Top 0.254: JTAG.3 29.23,10.13 RN1.8
N$14
  Top 0.254: JTAG.5 28.34,8.49 RN1.7
N$15
  Top 0.254: JTAG.7 27.54,8.49 RN1.6
N$16
  Top 0.254: JTAG.9 26.64,10.13 RN1.5
N$17
  Top 0.254: JTAG.11 R13.2
RTCK1
  Top 0.254: R13.1 21.59,21.01 IC9.33
SK  (via drill 0.38)
  Top 0.254: IC2.2 26.04,59.82 26.67,59.18 32.26,59.18 32.51,59.44 R4.1 | IC1.62 29.17,51.03 v30.23,49.98
  Top 0.305: JP3.4 25.4,67.39 23.95,68.83 22.43,68.83 21.67,68.07 21.67,60.53 v21.59,60.45 22.23,59.82 IC2.2
  Bottom 0.305: v30.23,49.98 30.23,57.4 27.18,60.45 v21.59,60.45
TCK1
  Top 0.254: IC9.34 26.09,19.05 26.67,19.05 26.67,18.78 RN1.4
TDI1
  Top 0.254: IC9.37 28.34,20.2 RN1.2
TDO1
  Top 0.254: IC9.32 18.5,19.06 RN2.1
TMS1
  Top 0.254: IC9.36 27.54,19.87 RN1.3
TRST1
  Top 0.254: IC9.38 29.23,20.43 RN1.1
TSRST1
  Top 0.254: IC9.31 17.61,19.29 RN2.2
V_TARGET  (via drill 0.38)
  Top 0.305: IC9.26 15.52,22.86 v14.61,22.86 C20.2
  Top 0.406: v33.02,20.95 C22.+ 35.42,19.28 D1.C 36.47,19.41 36.83,19.05 37.68,19.05 R12.1
  Bottom 0.305: v14.61,22.86 31.11,22.86 v33.02,20.95
V_TARGET_UNREG
  Top 0.406: 38.1,12.7 38.1,8.89 36.83,7.62 JTAG.1 | 38.1,12.7 JP4.2 | 38.1,12.7 R12.2
  Bottom 0.305: JTAG.2 JTAG.1
VPHY
  Top 0.254: IC1.4 22.13,48.99 21.59,49.53 20.49,49.53 C13.2
  Top 0.305: C13.2 20.23,49.44 20.09,49.3 C11.+ 14.96,49.3 14.82,49.44 L2.1
VPLL
  Top 0.254: IC1.9 18.55,46.49 17.53,45.47 C14.2
  Top 0.305: L1.1 12.28,44.03 12.45,44.2 14.25,44.2 C12.+ 14.45,44.45 15.75,44.45 16.17,44.03 C14.2

### Text on the board
tNames: GND | 3V3 | DAT | SK | CS | 3V3 | GND | IAN LESNET | TDO | JER | TDI | TCK | TMS | IO15 | IO14 | IO13 | v.trocio | v2.1a | IO12 | Bus Blaster | IO11 | CC-BY-SA 2011 | IO10 | IO09 | DBGACK | DBGRQ | TSRST | GND | RTCK | TRST | TDO | TCK | TMS | TDI | VTG | 3V3 | GND | VTG
bNames: GND | 3V3 | DATA | SK | CS | 3V3 | GND | TDO | TDI | TCK | TMS | IO15 | IO14 | IO13 | IO12 | seeedstudio.com | Seeed Studio | Fulfillment by: | dangerousprototypes.com | Bus Blaster v2.1 | IO11 | IO10 | IO09 | GND | 3V3 | DBGACK | DBGRQ | TSRST | TDO | RTCK | TCK | TMS | TDI | TRST | VTG | GND | GND | GND | GND | GND | GND | GND | GND | GND | VTG